# EAGLE design controller (EAGLE 9.5.2)
CNAME: Control Cube; CREVISION: 01; DESIGNER: Heng Teng Yi
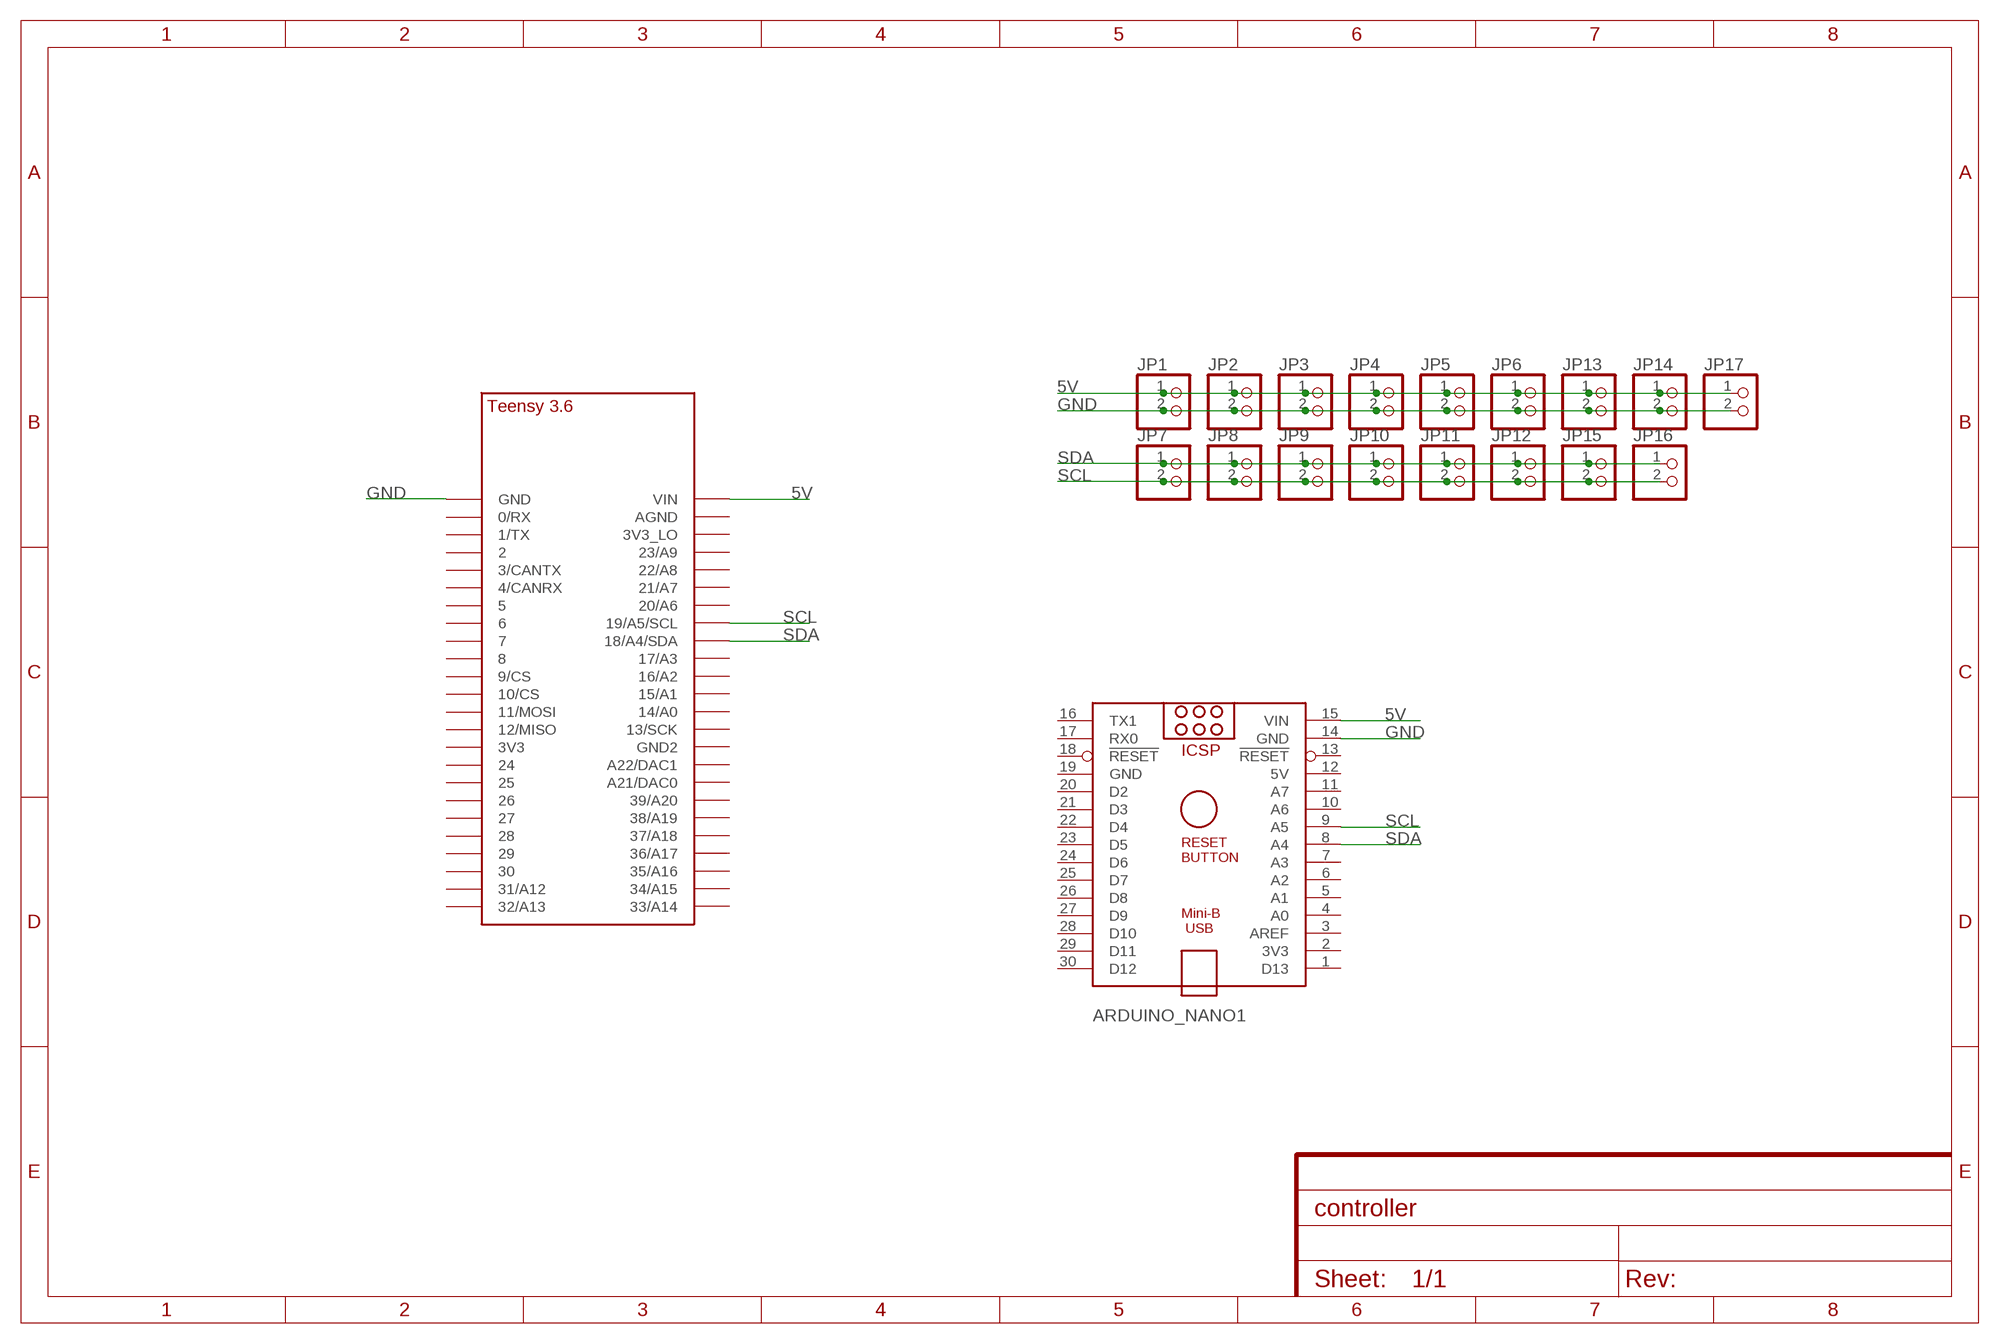
[diagram p0: schematic, sheet 1]

## Parts
ARDUINO_NANO1  ARDUINO_NANO  [ARDUINO_NANO]
JP1  PINHD-1X2  [1X02]
JP2  PINHD-1X2  [1X02]
JP3  PINHD-1X2  [1X02]
JP4  PINHD-1X2  [1X02]
JP5  PINHD-1X2  [1X02]
JP6  PINHD-1X2  [1X02]
JP7  PINHD-1X2  [1X02]
JP8  PINHD-1X2  [1X02]
JP9  PINHD-1X2  [1X02]
JP10  PINHD-1X2  [1X02]
JP11  PINHD-1X2  [1X02]
JP12  PINHD-1X2  [1X02]
JP13  PINHD-1X2  [1X02]
JP14  PINHD-1X2  [1X02]
JP15  PINHD-1X2  [1X02]
JP16  PINHD-1X2  [1X02]
JP17  PINHD-1X2  [1X02]
U$1  TEENSY_3.5/3.6_BASIC  [TEENSY_3.5/3.6_BASIC]

## Nets
5V: ARDUINO_NANO1.15(VIN) JP1.1 JP2.1 JP3.1 JP4.1 JP5.1 JP6.1 JP13.1 JP14.1 JP17.1 U$1.VIN
GND: ARDUINO_NANO1.14(GND) JP1.2 JP2.2 JP3.2 JP4.2 JP5.2 JP6.2 JP13.2 JP14.2 JP17.2 U$1.GND
SCL: ARDUINO_NANO1.9(A5) JP7.2 JP8.2 JP9.2 JP10.2 JP11.2 JP12.2 JP15.2 JP16.2 U$1.19/A5/SCL
SDA: ARDUINO_NANO1.8(A4) JP7.1 JP8.1 JP9.1 JP10.1 JP11.1 JP12.1 JP15.1 JP16.1 U$1.18/A4/SDA
Unconnected: ARDUINO_NANO1.1(D13) ARDUINO_NANO1.2(3V3) ARDUINO_NANO1.3(AREF) ARDUINO_NANO1.4(A0) ARDUINO_NANO1.5(A1) ARDUINO_NANO1.6(A2) ARDUINO_NANO1.7(A3) ARDUINO_NANO1.10(A6) ARDUINO_NANO1.11(A7) ARDUINO_NANO1.13(!RESET) ARDUINO_NANO1.16(TX1) ARDUINO_NANO1.17(RX0) ARDUINO_NANO1.18(!RESET) ARDUINO_NANO1.20(D2) ARDUINO_NANO1.21(D3) ARDUINO_NANO1.22(D4) ARDUINO_NANO1.23(D5) ARDUINO_NANO1.24(D6) ARDUINO_NANO1.25(D7) ARDUINO_NANO1.26(D8) ARDUINO_NANO1.27(D9) ARDUINO_NANO1.28(D10) ARDUINO_NANO1.29(D11) ARDUINO_NANO1.30(D12) U$1.0/RX U$1.1/TX U$1.2 U$1.3/CANTX U$1.3V3 U$1.3V3_LO U$1.4/CANRX U$1.5 U$1.6 U$1.7 U$1.8 U$1.9/CS U$1.10/CS U$1.11/MOSI U$1.12/MISO U$1.13/SCK U$1.14/A0 U$1.15/A1 U$1.16/A2 U$1.17/A3 U$1.20/A6 U$1.21/A7 U$1.21/DAC0(A21/DAC0) U$1.22/A8 U$1.23/A9 U$1.24 U$1.25 U$1.26 U$1.27 U$1.28 U$1.29 U$1.30 U$1.31/A12 U$1.32/A13 U$1.33/A14 U$1.34/A15 U$1.35/A16 U$1.36/A17 U$1.37/A18 U$1.38/A19 U$1.39/A20 U$1.A22/DAC1 U$1.AGND U$1.GND2

## Power pins joined to a net without a drawn wire
5V: ARDUINO_NANO1.12(5V)
GND: ARDUINO_NANO1.19(GND)

## Library data of the parts
ARDUINO_NANO1 = ArduinoNanoV30:ARDUINO_NANO: Arduino Nano V3.0 Overview: The Arduino Nano is a small, complete, and breadboard-friendly board based on the ATmega328 (Arduino Nano 3.x) or ATmega168 (Arduino Nano 2.x). It has more or less the same functionality of the Arduino Duemilanove, but in a different package. It lacks only a DC power jack, and works with a Mini-B USB cable instead of a standard one. The Nano was designed and is being produced by Gravitech. Specifications: Microcontroller Atmel ATmega168 or ATmega328 Operating Voltage (logic level) 5 V Input Voltage (recommended) 7-12 V Input Voltage (limits) 6-20 V Digital I/O Pins 14 (of which 6 provide PWM output) Analog Input Pins 8 DC Current per I/O Pin 40 mA Flash Memory 16 KB (ATmega168) or 32 KB (ATmega328) of which 2 KB used by bootloader SRAM 1 KB (ATmega168) or 2 KB (ATmega328) EEPROM 512 bytes (ATmega168) or 1 KB (ATmega328) Clock Speed 16 MHz Dimensions 0.73" x 1.70" Length 45 mm Width 18 mm Weigth 5 g Power: The Arduino Nano can be powered via the Mini-B USB connection, 6-20V unregulated external power supply (pin 30), or 5V regulated external power supply (pin 27). The power source is automatically selected to the highest voltage source. Memory: The ATmega168 has 16 KB of flash memory for storing code (of which 2 KB is used for the bootloader); the ATmega328 has 32 KB, (also with 2 KB used for the bootloader). The ATmega168 has 1 KB of SRAM and 512 bytes of EEPROM (which can be read and written with the EEPROM library); the ATmega328 has 2 KB of SRAM and 1 KB of EEPROM. Input and Output: Each of the 14 digital pins on the Nano can be used as an input or output, using pinMode(), digitalWrite(), and digitalRead() functions. They operate at 5 volts. Each pin can provide or receive a maximum of 40 mA and has an internal pull-up resistor (disconnected by default) of 20-50 kOhms. In addition, some pins have specialized functions. Visit Arduino - ArduinoBoardNano <https://www.arduino.cc/en/Main/ArduinoBoardNano>
JP1-JP17 = pinhead:PINHD-1X2: PIN HEADER
U$1 = Teensy356:TEENSY_3.5/3.6_BASIC

## Board
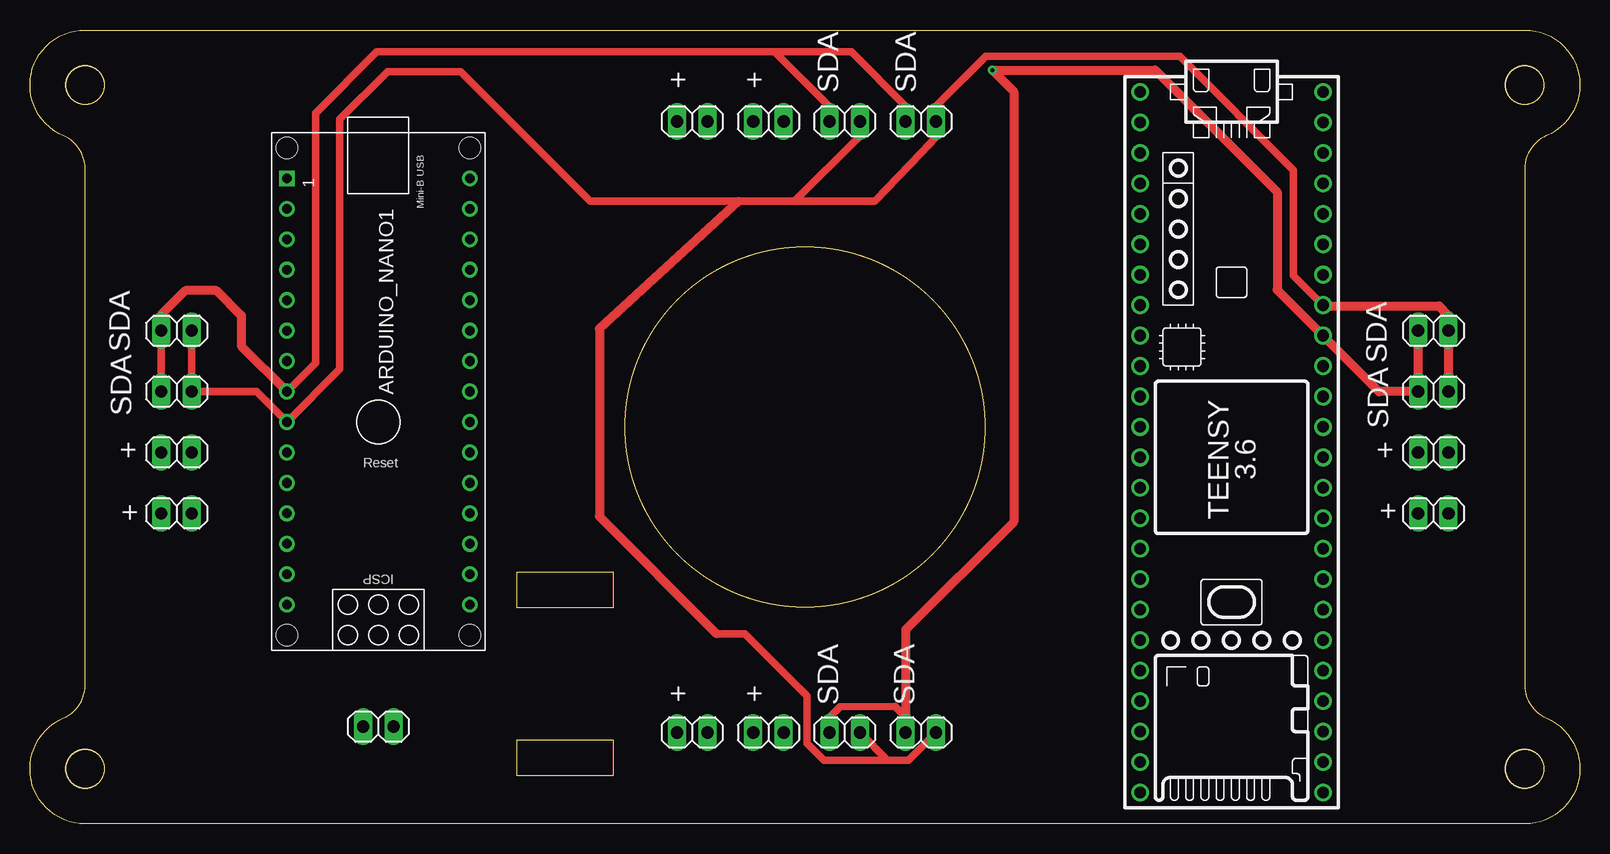
[diagram p1: board, top side]
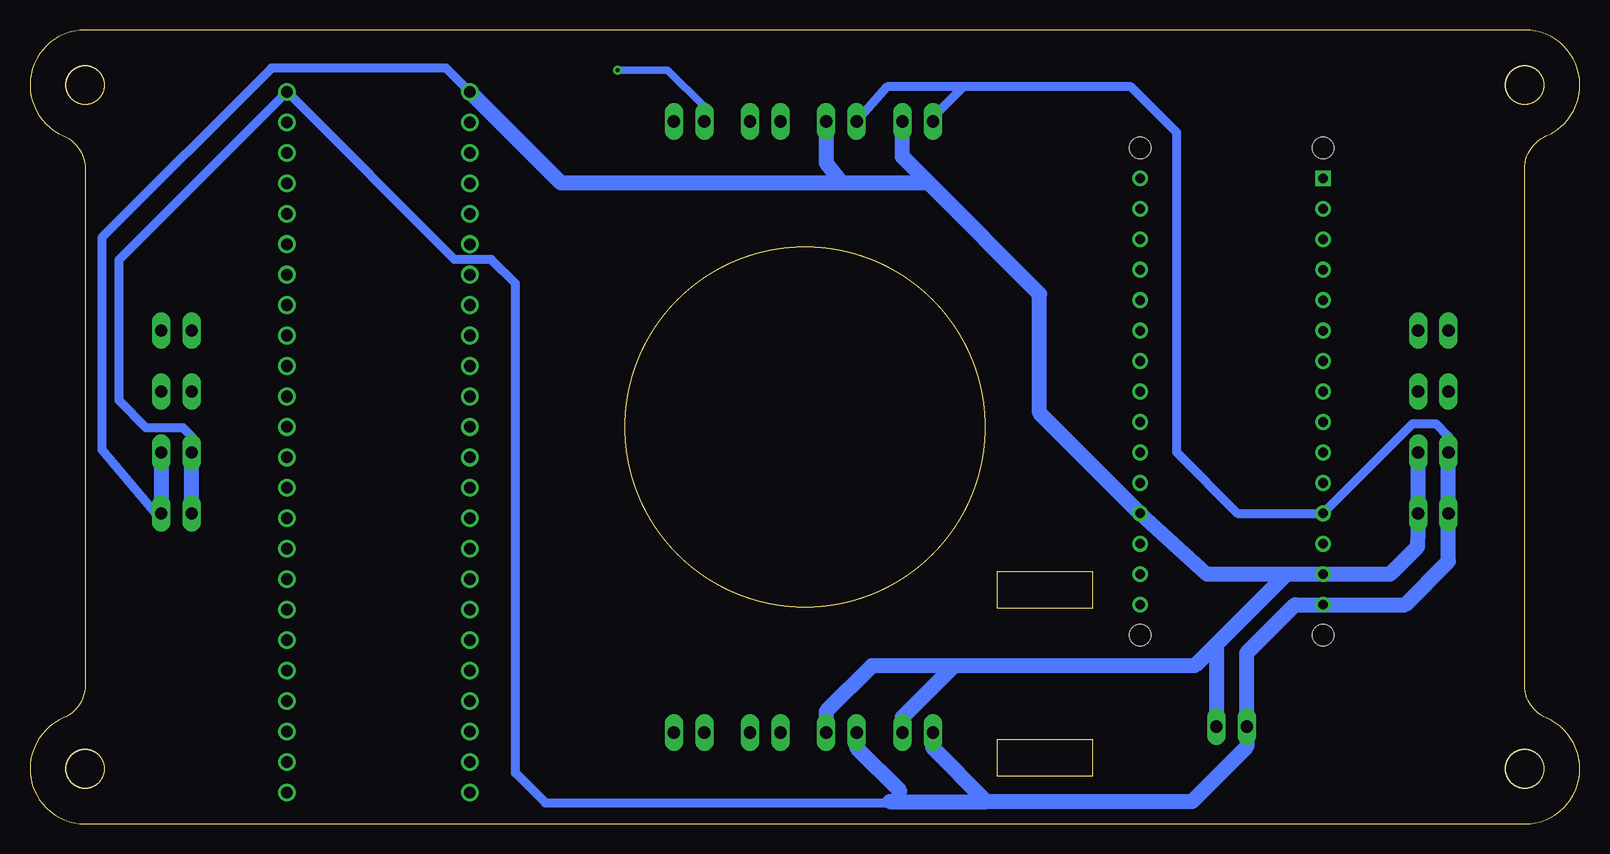
[diagram p2: board, bottom side, seen from below]

Size 129.2 x 66.2 mm. Coordinates in mm from the lower left corner, seen from the top.
Outline: 4.6,0 arc-157 2.78,8.83 arc67 4.6,11.58 4.6,54.62 arc67 2.78,57.37 arc-157 4.6,66.2 124.6,66.2 arc-157 126.42,57.37 arc67 124.6,54.62 124.6,11.58 arc67 126.42,8.83 arc-157 124.6,0 4.6,0
Outline: 40.6,21 48.6,21 48.6,18 40.6,18 40.6,21
Outline: 40.6,7 48.6,7 48.6,4 40.6,4 40.6,7
Outline: circle at 64.6,33.1 radius 15
Outline: circle at 4.6,4.6 radius 1.6
Outline: circle at 4.6,61.6 radius 1.6
Outline: circle at 124.6,4.6 radius 1.6
Outline: circle at 124.6,61.6 radius 1.6
Outline: circle at 64.6,33.1 radius 15
Copper layers (1*16): Top 0.035mm / dielectric 1.5mm / Bottom 0.035mm
Design rules "default": minimum track width 6mil, minimum drill 0.35mm, track to track 6mil, track to pad 6mil, pad to pad 6mil, via to via 6mil, smd to smd 6mil, copper to edge 40mil, drill to drill 6mil, minimum pad ring 10mil, minimum via ring 8mil, stop-mask expansion 4mil, vias tented up to drill 0mil, thermal gap 10mil
Holes 30 mm at 64.6,33.1
Holes 3.2 mm at 4.6,4.6 4.6,61.6 124.6,4.6 124.6,61.6

### Footprints (pad centres in the part's own frame; a part is rotated, then mirrored left to right if it is on the bottom)
ARDUINO_NANO = drill 0.8 square: 1 -20.32,-7.62 | drill 0.8: 2 -17.78,-7.62; 3 -15.24,-7.62; 4 -12.7,-7.62; 5 -10.16,-7.62; 6 -7.62,-7.62; 7 -5.08,-7.62; 8 -2.54,-7.62; 9 0,-7.62; 10 2.54,-7.62; 11 5.08,-7.62; 12 7.62,-7.62; 13 10.16,-7.62; 14 12.7,-7.62; 15 15.24,-7.62; 16 15.24,7.62; 17 12.7,7.62; 18 10.16,7.62; 19 7.62,7.62; 20 5.08,7.62; 21 2.54,7.62; 22 0,7.62; 23 -2.54,7.62; 24 -5.08,7.62; 25 -7.62,7.62; 26 -10.16,7.62; 27 -12.7,7.62; 28 -15.24,7.62; 29 -17.78,7.62; 30 -20.32,7.62 | hole 1.778: -22.86,-7.62; -22.86,7.62; 17.78,7.62; 17.78,-7.62
1X02 = drill 1.016 long: 1 -1.27,0; 2 1.27,0
TEENSY_3.5/3.6_BASIC = drill 0.965: 0/RX -25.4,-7.62; 1/TX -22.86,-7.62; 2 -20.32,-7.62; 3/CANTX -17.78,-7.62; 3V3 7.62,-7.62; 3V3_LO -22.86,7.62; 4/CANRX -15.24,-7.62; 5 -12.7,-7.62; 6 -10.16,-7.62; 7 -7.62,-7.62; 8 -5.08,-7.62; 9/CS -2.54,-7.62; 10/CS 0,-7.62; 11/MOSI 2.54,-7.62; 12/MISO 5.08,-7.62; 13/SCK 5.08,7.62; 14/A0 2.54,7.62; 15/A1 0,7.62; 16/A2 -2.54,7.62; 17/A3 -5.08,7.62; 18/A4/SDA -7.62,7.62; 19/A5/SCL -10.16,7.62; 20/A6 -12.7,7.62; 21/A7 -15.24,7.62; 21/DAC0 12.7,7.62; 22/A8 -17.78,7.62; 23/A9 -20.32,7.62; 24 10.16,-7.62; 25 12.7,-7.62; 26 15.24,-7.62; 27 17.78,-7.62; 28 20.32,-7.62; 29 22.86,-7.62; 30 25.4,-7.62; 31/A12 27.94,-7.62; 32/A13 30.48,-7.62; 33/A14 30.48,7.62; 34/A15 27.94,7.62; 35/A16 25.4,7.62; 36/A17 22.86,7.62; 37/A18 20.32,7.62; 38/A19 17.78,7.62; 39/A20 15.24,7.62; A22/DAC1 10.16,7.62; AGND -25.4,7.62; GND -27.94,-7.62; GND2 7.62,7.62; VIN -27.94,7.62

### Placement (x,y rotation side)
ARDUINO_NANO1  29.04,33.51 270 top
JP1  29.04,8.11 0 top
JP2  55.21,7.62 0 top
JP3  61.56,7.62 0 top
JP4  116.98,25.89 0 top
JP5  116.98,30.97 0 top
JP6  55.21,58.58 0 top
JP7  74.26,7.62 0 top
JP8  67.91,7.62 0 top
JP9  116.98,41.13 0 top
JP10  116.98,36.05 0 top
JP11  67.91,58.58 0 top
JP12  74.26,58.58 0 top
JP13  61.56,58.58 0 top
JP14  12.22,30.97 0 top
JP15  12.22,36.05 0 top
JP16  12.22,41.13 0 top
JP17  12.22,25.89 0 top
U$1  100.16,33.1 270 top

### Tracks (layer width: path | path; a pad name or v marks a point on that pad's centre or on a via)
5V
  Bottom 0.762: JP5.1 115.71,32.3 116.44,33.03 119.49,33.03 121.78,35.32 121.78,47.04 U$1.VIN 93.81,47.07 90.74,47.07 88.73,45.06 88.73,4.26 86.22,1.75 66.51,1.75 57.62,1.76 57.52,1.87 56.69,2.75 | 51.4,61.45 37.43,61.45 33.62,57.64 33.62,30.97 28.54,25.89 ARDUINO_NANO1.12 13.93,33.39 12.03,33.39 10.95,32.31 JP14.1 | JP6.1 53.94,58.91 51.4,61.45 | 51.4,61.45 57.75,61.45 JP13.1
  Bottom 1.27: 49.45,1.87 32.34,1.87 27.77,6.43 JP1.1 27.77,14.25 23.74,18.27 ARDUINO_NANO1.15 14.57,18.27 10.95,21.89 JP17.1 JP14.1 | JP2.1 53.94,6.35 49.45,1.87 | JP3.1 60.29,6.35 56.69,2.75 | 57.52,1.87 49.45,1.87 | JP4.1 JP5.1
GND
  Bottom 0.762: U$1.GND 94.52,63.02 109.05,63.02 123.2,48.88 123.2,31.2 118.71,25.89 JP4.2
  Bottom 1.27: 30.31,14.99 JP1.2 | 24.48,20.81 30.31,14.99 | 24.48,20.81 ARDUINO_NANO1.14 15.84,20.81 13.55,23.1 JP17.2 JP14.2 | 24.48,20.81 31.08,20.81 ARDUINO_NANO1.19 45.05,34.28 45.05,44.2 54.31,53.46 | JP2.2 56.48,8.89 52.17,13.19 | 30.31,14.99 32.1,13.19 52.17,13.19 | 52.17,13.19 59.02,13.19 62.83,9.38 JP3.2 | JP6.2 56.48,55.63 54.31,53.46 | 61.56,53.46 84.96,53.46 U$1.GND | 61.56,53.46 54.31,53.46 | JP13.2 62.83,55.1 61.56,53.46 | JP5.2 JP4.2
SCL
  Top 0.61: JP16.2 JP15.2 18.88,36.05 ARDUINO_NANO1.9 25.83,37.93 25.83,58.75 29.81,62.72 35.88,62.72 46.67,51.93 59.06,51.93 63.74,51.93 | JP7.2 75.53,7.61 73.24,5.32 71.48,5.32 | JP11.2 69.18,57.36 63.74,51.93 | U$1.19/A5/SCL 105.32,45.72 105.32,54.52 95.85,63.99 79.67,63.99 75.53,59.85 JP12.2 75.53,57.25 74.26,55.92 70.45,51.93 63.74,51.93 | 57.24,15.86 59.61,15.86 64.78,10.69 64.78,6.73 66.2,5.32 71.48,5.32 | 71.48,5.32 JP8.2
  Top 0.762: U$1.19/A5/SCL 107.85,43.19 117.46,43.19 118.25,42.4 JP9.2 JP10.2 | 59.06,51.93 47.46,41.29 47.46,25.64 57.24,15.86
SDA  (via drill 0.35)
  Top 0.61: JP15.1 JP16.1 | JP7.1 72.99,8.89 72.09,9.78 67.5,9.76 66.64,8.89 JP8.1 | ARDUINO_NANO1.8 23.8,38.43 23.8,59.26 28.91,64.37 62.06,64.37 | JP11.1 66.64,59.8 62.06,64.37 | 62.06,64.37 68.47,64.37 72.99,59.85 JP12.1
  Top 0.762: ARDUINO_NANO1.8 17.61,39.86 17.61,42.4 15.55,44.46 12.95,44.46 10.95,42.46 JP16.1 | JP9.1 JP10.1 112.45,36.05 U$1.18/A4/SDA 103.97,44.53 103.97,52.68 93.8,62.85 v80.23,62.85 82,61.07 82,25.2 72.99,16.18 JP7.1
  Bottom 0.61: v80.23,62.85 76.04,62.85 72.99,59.8 JP12.1

### Text on the board
tPlace: + | + | SDA | SDA | SDA | SDA | SDA | SDA | + | + | + | + | + | + | SDA | SDA